# EAGLE design KGGR_MV_su (EAGLE 9.4.2)
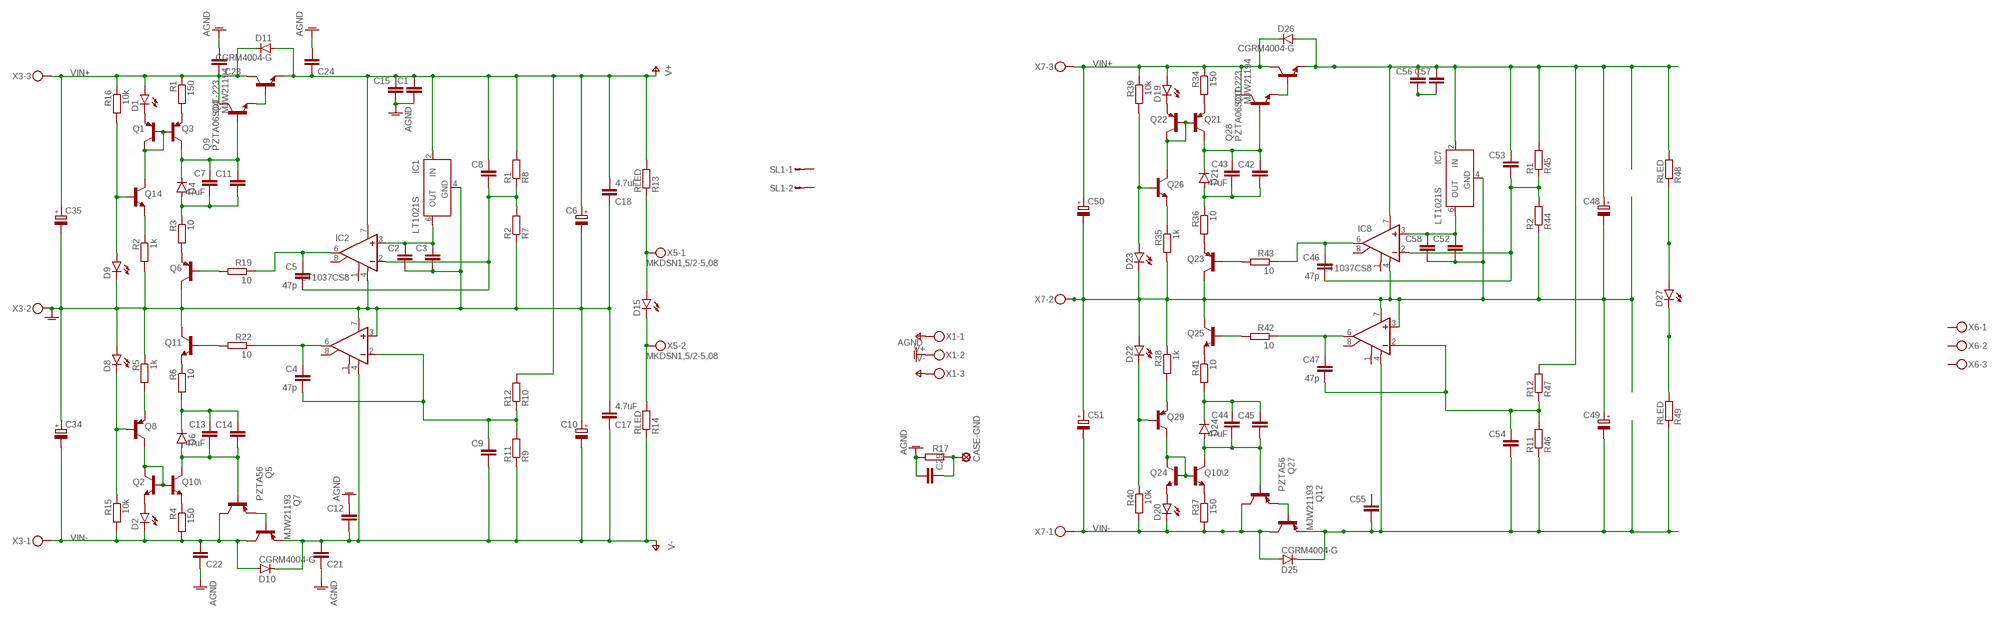
[diagram p0: schematic, sheet 1]

## Parts
C1  C-EUC0805  [C0805]
C2  C-EUC0805  [C0805]
C3  C-EUC0805  [C0805]
C4  47p  C-EUC0805  [C0805]
C5  47p  C-EUC0805  [C0805]
C6  CPOL-EUE5-13  [E5-13]
C7  47uF  C-EUC1206  [C1206]
C8  C-EUC0805  [C0805]
C9  C-EUC0805  [C0805]
C10  CPOL-EUE5-13  [E5-13]
C11  C-EUC0805  [C0805]
C12  C-EUC0805  [C0805]
C13  47uF  C-EUC1206  [C1206]
C14  C-EUC0805  [C0805]
C15  C-EUC0805  [C0805]
C17  4.7uF  C-EU050-075X075  [C050-075X075]
C18  4.7uF  C-EU050-075X075  [C050-075X075]
C21  C-EU050-035X075  [C050-035X075]
C22  C-EU050-075X075  [C050-075X075]
C23  C-EU050-075X075  [C050-075X075]
C24  C-EU050-035X075  [C050-035X075]
C29  C-EU102_152-062X184  [C102_152-062X184]
C34  CPOL-EUE7.5-18  [E7,5-18]
C35  CPOL-EUE7.5-18  [E7,5-18]
C42  C-EUC0805  [C0805]
C43  47uF  C-EUC1206  [C1206]
C44  47uF  C-EUC1206  [C1206]
C45  C-EUC0805  [C0805]
C46  47p  C-EUC0805  [C0805]
C47  47p  C-EUC0805  [C0805]
C48  CPOL-EUE5-13  [E5-13]
C49  CPOL-EUE5-13  [E5-13]
C50  CPOL-EUE7.5-18  [E7,5-18]
C51  CPOL-EUE7.5-18  [E7,5-18]
C52  C-EUC0805  [C0805]
C53  C-EUC0805  [C0805]
C54  C-EUC0805  [C0805]
C55  C-EUC0805  [C0805]
C56  C-EUC0805  [C0805]
C57  C-EUC0805  [C0805]
C58  C-EUC0805  [C0805]
CASE-GND  SE14  [SE14]
D1  LEDSML0805  [SML0805]
D2  LEDSML0805  [SML0805]
D4  TZMC10  DIODE-SOD80C  [SOD80C]
D6  TZAMC10  DIODE-SOD80C  [SOD80C]
D8  LEDSML0805  [SML0805]
D9  LEDSML0805  [SML0805]
D10  CGRM4004-G  [SOD-123_MINI-SMA]
D11  CGRM4004-G  [SOD-123_MINI-SMA]
D15  LEDSML0805  [SML0805]
D19  LEDSML0805  [SML0805]
D20  LEDSML0805  [SML0805]
D21  TZMC10  DIODE-SOD80C  [SOD80C]
D22  LEDSML0805  [SML0805]
D23  LEDSML0805  [SML0805]
D24  TZAMC10  DIODE-SOD80C  [SOD80C]
D25  CGRM4004-G  [SOD-123_MINI-SMA]
D26  CGRM4004-G  [SOD-123_MINI-SMA]
D27  LEDSML0805  [SML0805]
IC1  LT1021S  [SOIC8]
IC2  LT1037CS8  [SOIC8]
IC3  LT1037CS8  [SOIC8]
IC7  LT1021S  [SOIC8]
IC8  LT1037CS8  [SO08]
IC9  LT1037CS8  [SO08]
Q1  TRANSISTOR_BC857C-PNP-SOT23-BEC  [TRANSISTOR_SOT23-BEC]
Q2  TRANSISTOR_BC847CLT1-NPN-SOT23-BEC  [TRANSISTOR_SOT23-BEC]
Q3  TRANSISTOR_BC857C-PNP-SOT23-BEC  [TRANSISTOR_SOT23-BEC]
Q4  MJW21194  MJL4281  [TO-264]
Q5  PZTA56  [SOT223]
Q6  TRANSISTOR_BC857C-PNP-SOT23-BEC  [TRANSISTOR_SOT23-BEC]
Q7  MJW21193  MJL4302  [TO-264]
Q8  TRANSISTOR_BC857C-PNP-SOT23-BEC  [TRANSISTOR_SOT23-BEC]
Q9  PZTA06SOT-223  [SOT223]
Q10  MJW21194  MJL4281  [TO-264]
Q10\  TRANSISTOR_BC847CLT1-NPN-SOT23-BEC  [TRANSISTOR_SOT23-BEC]
Q10\2  TRANSISTOR_BC847CLT1-NPN-SOT23-BEC  [TRANSISTOR_SOT23-BEC]
Q11  TRANSISTOR_BC847CLT1-NPN-SOT23-BEC  [TRANSISTOR_SOT23-BEC]
Q12  MJW21193  MJL4302  [TO-264]
Q14  TRANSISTOR_BC847CLT1-NPN-SOT23-BEC  [TRANSISTOR_SOT23-BEC]
Q21  TRANSISTOR_BC857C-PNP-SOT23-BEC  [TRANSISTOR_SOT23-BEC]
Q22  TRANSISTOR_BC857C-PNP-SOT23-BEC  [TRANSISTOR_SOT23-BEC]
Q23  TRANSISTOR_BC857C-PNP-SOT23-BEC  [TRANSISTOR_SOT23-BEC]
Q24  TRANSISTOR_BC847CLT1-NPN-SOT23-BEC  [TRANSISTOR_SOT23-BEC]
Q25  TRANSISTOR_BC847CLT1-NPN-SOT23-BEC  [TRANSISTOR_SOT23-BEC]
Q26  TRANSISTOR_BC847CLT1-NPN-SOT23-BEC  [TRANSISTOR_SOT23-BEC]
Q27  PZTA56  [SOT223]
Q28  PZTA06SOT-223  [SOT223]
Q29  TRANSISTOR_BC857C-PNP-SOT23-BEC  [TRANSISTOR_SOT23-BEC]
R1  150  R-EU_MELF0204W  [MINI_MELF-0204W]
R2  1k  R-EU_MELF0204W  [MINI_MELF-0204W]
R3  10  R-EU_MELF0204W  [MINI_MELF-0204W]
R4  150  R-EU_MELF0204W  [MINI_MELF-0204W]
R5  1k  R-EU_MELF0204W  [MINI_MELF-0204W]
R6  10  R-EU_MELF0204W  [MINI_MELF-0204W]
R7  R2  R-EU_MELF0204W  [MINI_MELF-0204W]
R8  R1  R-EU_MELF0204W  [MINI_MELF-0204W]
R9  R11  R-EU_MELF0204W  [MINI_MELF-0204W]
R10  R12  R-EU_MELF0204W  [MINI_MELF-0204W]
R13  RLED  R-EU_MELF0204W  [MINI_MELF-0204W]
R14  RLED  R-EU_MELF0204W  [MINI_MELF-0204W]
R15  10k  R-EU_MELF0204W  [MINI_MELF-0204W]
R16  10k  R-EU_MELF0204W  [MINI_MELF-0204W]
R17  R-EU_0617/22  [0617/22]
R19  10  R-EU_MELF0204W  [MINI_MELF-0204W]
R22  10  R-EU_MELF0204W  [MINI_MELF-0204W]
R34  150  R-EU_MELF0204W  [MINI_MELF-0204W]
R35  1k  R-EU_MELF0204W  [MINI_MELF-0204W]
R36  10  R-EU_MELF0204W  [MINI_MELF-0204W]
R37  150  R-EU_MELF0204W  [MINI_MELF-0204W]
R38  1k  R-EU_MELF0204W  [MINI_MELF-0204W]
R39  10k  R-EU_MELF0204W  [MINI_MELF-0204W]
R40  10k  R-EU_MELF0204W  [MINI_MELF-0204W]
R41  10  R-EU_MELF0204W  [MINI_MELF-0204W]
R42  10  R-EU_MELF0204W  [MINI_MELF-0204W]
R43  10  R-EU_MELF0204W  [MINI_MELF-0204W]
R44  R2  R-EU_MELF0204W  [MINI_MELF-0204W]
R45  R1  R-EU_MELF0204W  [MINI_MELF-0204W]
R46  R11  R-EU_MELF0204W  [MINI_MELF-0204W]
R47  R12  R-EU_MELF0204W  [MINI_MELF-0204W]
R48  RLED  R-EU_MELF0204W  [MINI_MELF-0204W]
R49  RLED  R-EU_MELF0204W  [MINI_MELF-0204W]
SL1  M02S  [02P]
X1  MKDSN1,5/3-5,08  [MKDSN1,5/3-5,08]
X3  MKDSN1,5/3-5,08  [MKDSN1,5/3-5,08]
X5  MKDSN1,5/2-5,08  [MKDSN1,5/2-5,08]
X6  MKDSN1,5/3-5,08  [MKDSN1,5/3-5,08]
X7  MKDSN1,5/3-5,08  [MKDSN1,5/3-5,08]

## Nets
AGND: C1.2 C2.2 C3.2 C6.- C10.+ C12.1 C15.2 C17.2 C18.1 C21.1 C22.1 C23.2 C24.2 C29.2 C29.3 C34.+ C35.- C48.- C49.+ C50.- C51.+ C52.2 C55.1 C56.2 C57.2 C58.2 D8.A D9.C D22.A D23.C IC1.4(GND) IC2.4(V-) IC3.3(+IN) IC3.7(V+) IC7.4(GND) IC8.4(V-) IC9.3(+IN) IC9.7(V+) Q6.C Q11.C Q23.C Q25.C R2.2 R5.1 R7.1 R17.2 R35.2 R38.1 R44.1 X1.2 X3.2 X6.2 X7.2
N$1: Q1.B Q1.C Q3.B Q14.C
N$2: D1.C Q1.E
N$3: Q3.E R1.2
N$5: C7.1 C11.1 D4.C Q3.C Q9.1(B)
N$6: C7.2 C11.2 D4.A R3.1
N$7: Q6.E R3.2
N$8: Q14.E R2.1
N$9: D9.A Q14.B R16.2
N$10: C4.1 IC3.6(OUT) R22.1
N$11: Q8.E R5.2
N$12: D8.C Q8.B R15.1
N$13: Q11.E R6.1
N$14: C13.1 C14.1 D6.C R6.2
N$15: C13.2 C14.2 D6.A Q5.1(B) Q10\.C
N$16: Q2.B Q2.C Q8.C Q10\.B
N$17: Q5.3(E) Q7.B
N$18: Q10\.E R4.1
N$19: D2.A Q2.E
N$21: Q4.B Q9.3(E)
N$24: C4.2 C9.1 IC3.2(-IN) R9.2 R10.1
N$25: C5.1 IC2.6(OUT) R19.1
N$26: Q11.B R22.2
N$27: Q6.B R19.2
N$28: C5.2 C8.2 IC2.2(-IN) R7.2 R8.1
N$29: C2.1 C3.1 IC1.6(OUT) IC2.3(+IN)
N$32: D15.C R14.2 X5.2
N$36: D15.A R13.1 X5.1
N$41: C29.1 CASE-GND.MP R17.1
N$56: Q21.B Q22.B Q22.C Q26.C
N$57: D19.C Q22.E
N$58: Q21.E R34.2
N$59: C42.1 C43.1 D21.C Q21.C Q28.1(B)
N$60: C42.2 C43.2 D21.A R36.1
N$61: Q23.E R36.2
N$62: Q26.E R35.1
N$63: D23.A Q26.B R39.2
N$64: Q29.E R38.2
N$65: D22.C Q29.B R40.1
N$66: Q25.E R41.1
N$67: C44.1 C45.1 D24.C R41.2
N$68: C44.2 C45.2 D24.A Q10\2.C Q27.1(B)
N$69: Q10\2.B Q24.B Q24.C Q29.C
N$70: Q10\2.E R37.1
N$71: D20.A Q24.E
N$72: Q12.B Q27.3(E)
N$73: Q10.B Q28.3(E)
N$74: Q25.B R42.2
N$75: Q23.B R43.2
N$76: C46.2 C53.2 IC8.2(-IN) R44.2 R45.1
N$77: D27.C R49.2
N$78: D27.A R48.1
N$79: C47.1 IC9.6(OUT) R42.1
N$80: C47.2 C54.1 IC9.2(-IN) R46.2 R47.1
N$81: C52.1 C58.1 IC7.6(OUT) IC8.3(+IN)
N$82: C46.1 IC8.6(OUT) R43.1
V+: C1.1 C6.+ C8.1 C15.1 C18.2 C24.1 D11.A IC1.2(IN) IC2.7(V+) Q4.E R8.2 R10.2 R13.2 X1.1
V+2: C48.+ C53.1 C56.1 C57.1 D26.A IC7.2(IN) IC8.7(V+) Q10.E R45.2 R47.2 R48.2 X6.1
V-: C9.2 C10.- C12.2 C17.1 C21.2 D10.C IC3.4(V-) Q7.E R9.1 R14.1 X1.3
V-2: C49.- C54.2 C55.2 D25.C IC9.4(V-) Q12.E R46.1 R49.1 X6.3
VIN+: C23.1 C35.+ C50.+ D1.A D11.C D19.A D26.C Q4.C Q9.2(C) Q9.4(C) Q10.C Q28.2(C) Q28.4(C) R1.1 R16.1 R34.1 R39.1 X3.3 X7.3
VIN-: C22.2 C34.- C51.- D2.C D10.A D20.C D25.A Q5.2(C) Q5.4(C) Q7.C Q12.C Q27.2(C) Q27.4(C) R4.2 R15.2 R37.2 R40.2 X3.1 X7.1
Unconnected: IC2.1(CMP1) IC2.8(CMP2) IC3.1(CMP1) IC3.8(CMP2) IC8.1(CMP1) IC8.8(CMP2) IC9.1(CMP1) IC9.8(CMP2) SL1.1 SL1.2

## Library data of the parts
C1-C5 C7-C9 C11-C15 C17 C18 C21-C24 C29 C42-C47 C52-C58 = Vwvwbg:C-EU: CAPACITOR, European symbol
C6 C10 C34 C35 C48-C51 = Vwvwbg:CPOL-EU: POLARIZED CAPACITOR, European symbol
CASE-GND = solpad:SE14: SOLDER PAD E1553, drill 1,4mm, distributor Buerklin, 07F820
D1 D2 D8 D9 D15 D19 D20 D22 D23 D27 = led:LED: LED OSRAM: - CHIPLED LG R971, LG N971, LY N971, LG Q971, LY Q971, LO R971, LY R971 LH N974, LH R974 LS Q976, LO Q976, LY Q976 LO Q996 - Hyper CHIPLED LW Q18S LB Q993, LB Q99A, LB R99A - SideLED LS A670, LO A670, LY A670, LG A670, LP A670 LB A673, LV A673, LT A673, LW A673 LH A674 LY A675 LS A676, LA A676, LO A676, LY A676, LW A676 LS A679, LY A679, LG A679 - Hyper Micro SIDELED® LS Y876, LA Y876, LO Y876, LY Y876 LT Y87S - SmartLED LW L88C, LW L88S LB L89C, LB L89S, LG L890 LS L89K, LO L89K, LY L89K LS L896, LA L896, LO L896, LY L896 - TOPLED LS T670, LO T670, LY T670, LG T670, LP T670 LSG T670, LSP T670, LSY T670, LOP T670, LYG T670 LG T671, LOG T671, LSG T671 LB T673, LV T673, LT T673, LW T673 LH T674 LS T676, LA T676, LO T676, LY T676, LB T676, LH T676, LSB T676, LW T676 LB T67C, LV T67C, LT T67C, LS T67K, LO T67K, LY T67K, LW E67C LS E67B, LA E67B, LO E67B, LY E67B, LB E67C, LV E67C, LT E67C LW T67C LS T679, LY T679, LG T679 LS T770, LO T770, LY T770, LG T770, LP T770 LB T773, LV T773, LT T773, LW T773 LH T774 LS E675, LA E675, LY E675, LS T675 LS T776, LA T776, LO T776, LY T776, LB T776 LHGB T686 LT T68C, LB T68C - Hyper Mini TOPLED® LB M676 - Mini TOPLED Santana® LG M470 LS M47K, LO M47K, LY M47K Source: http://www.osram.convergy.de LUXEON: - LUMILED® LXK2-PW12-R00, LXK2-PW12-S00, LXK2-PW14-U00, LXK2-PW14-V00 LXK2-PM12-R00, LXK2-PM12-S00, LXK2-PM14-U00 LXK2-PE12-Q00, LXK2-PE12-R00, LXK2-PE12-S00, LXK2-PE14-T00, LXK2-PE14-U00 LXK2-PB12-K00, LXK2-PB12-L00, LXK2-PB12-M00, LXK2-PB14-N00, LXK2-PB14-P00, LXK2-PB14-Q00 LXK2-PR12-L00, LXK2-PR12-M00, LXK2-PR14-Q00, LXK2-PR14-R00 LXK2-PD12-Q00, LXK2-PD12-R00, LXK2-PD12-S00 LXK2-PH12-R00, LXK2-PH12-S00 LXK2-PL12-P00, LXK2-PL12-Q00, LXK2-PL12-R00 Source: www.luxeon.com KINGBRIGHT: KA-3528ASYC Source: www.kingbright.com
D4 D6 D21 D24 = diode:DIODE-: DIODE
D10 D11 D25 D26 = diode:CGRM400*-G: Molded plasitc,JEDEC SOD-123/Mini SMA Source: Comchip CGRM4001-G.pdf
IC1 = Vwvwbg:LT1021: Precision Reference Source: http://www.linear.com/pc/downloadDocument.do?navId=H0,C1,C1010,C1603,P1229,D2805; MPN: LT1021DCS8-10#PBF; OC_FARNELL: 1273428; OC_NEWARK: 57M0993
IC2 IC3 = Vwvwbg:LT10*: Low Noise, High Speed, Precision Operational Amplifiers Source: http://www.linear.com/pc/downloadDocument.do?navId=H0,C1,C1154,C1009,C1026,P1212,D2204
IC7 = linear-technology:LT1021: Precision Reference Source: http://www.linear.com/pc/downloadDocument.do?navId=H0,C1,C1010,C1603,P1229,D2805; MPN: LT1021DCS8-10#PBF; OC_FARNELL: 1273428; OC_NEWARK: 57M0993
IC8 IC9 = linear:LT10*: Low Noise, High Speed, Precision Operational Amplifiers Source: http://www.linear.com/pc/downloadDocument.do?navId=H0,C1,C1154,C1009,C1026,P1212,D2204
Q1 Q3 Q6 Q8 Q21-Q23 Q29 = Vwvwbg:TRANSISTOR_*-PNP-: PNP Transistror
Q2 Q10\ Q10\2 Q11 Q14 Q24-Q26 = Vwvwbg:TRANSISTOR_*-NPN-: NPN Transistror BF959 corrected 2008.03.06
Q4 Q10 = TO264:MJL4281: MJL4281 NPN BCE TO-264
Q5 Q27 = Vwvwbg:PZTA56
Q7 Q12 = TO264:MJL4302: MJL4302 PNP BCE TO-264
Q9 Q28 = Vwvwbg:PZTA06
R1-R10 R13-R17 R19 R22 R34-R49 = Vwvwbg:R-EU_: RESISTOR, European symbol
SL1 = con-amp-quick:M02S: AMP QUICK CONNECTOR; OC_FARNELL: unknown; OC_NEWARK: unknown
X1 X3 X6 X7 = con-phoenix-508:MKDSN1,5/3-5,08: MKDSN 1,5/ 3-5,08 Printklemme Nennstrom: 13,5 A Nennspannung: 250 V Rastermaß: 5,08 mm Polzahl: 3 Anschlussart: Schraubanschluss Montage: Löten Anschlussrichtung Leiter/Platine: 0 ° Artikelnummer: 1729131 Source: http://eshop.phoenixcontact.com .. 1729131.pdf
X5 = con-phoenix-508:MKDSN1,5/2-5,08: MKDSN 1,5/ 2-5,08 Printklemme Nennstrom: 13,5 A Nennspannung: 250 V Rastermaß: 5,08 mm Polzahl: 2 Anschlussart: Schraubanschluss Montage: Löten Anschlussrichtung Leiter/Platine: 0 ° Artikelnummer: 1729128 Source: http://eshop.phoenixcontact.com .. 1729128.pdf

## Board
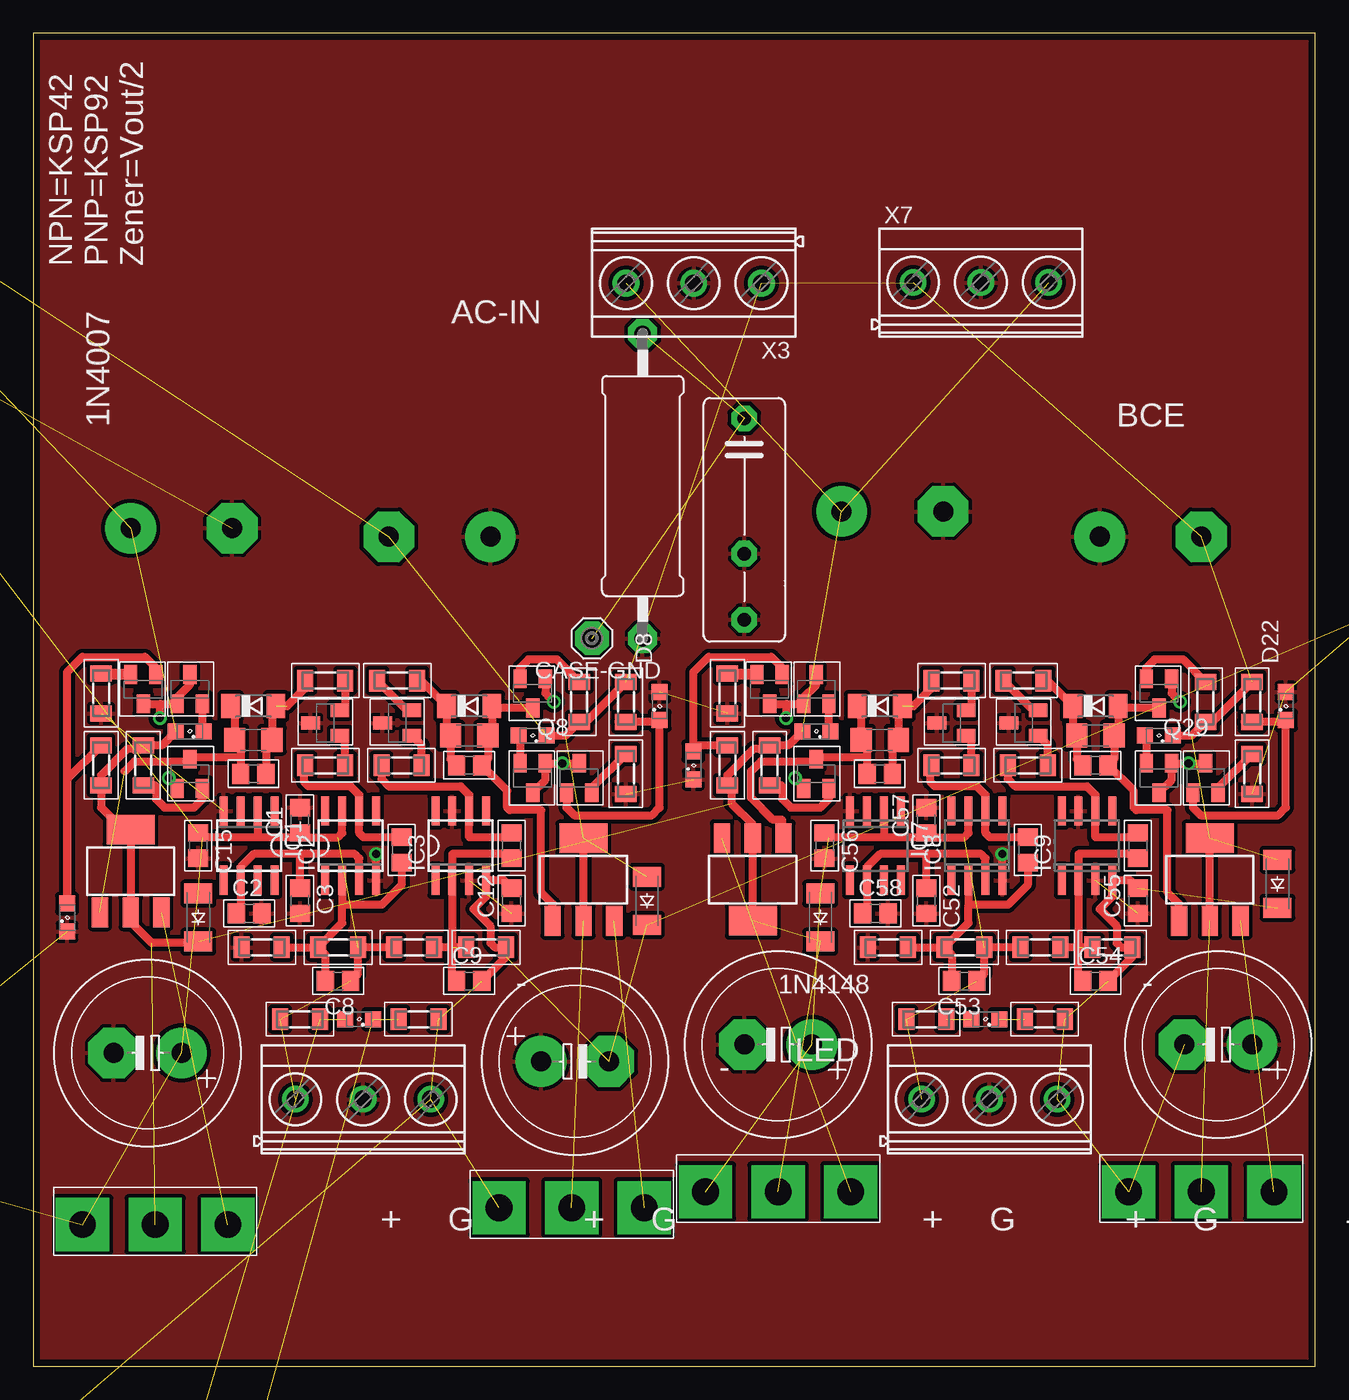
[diagram p1: board, top side]
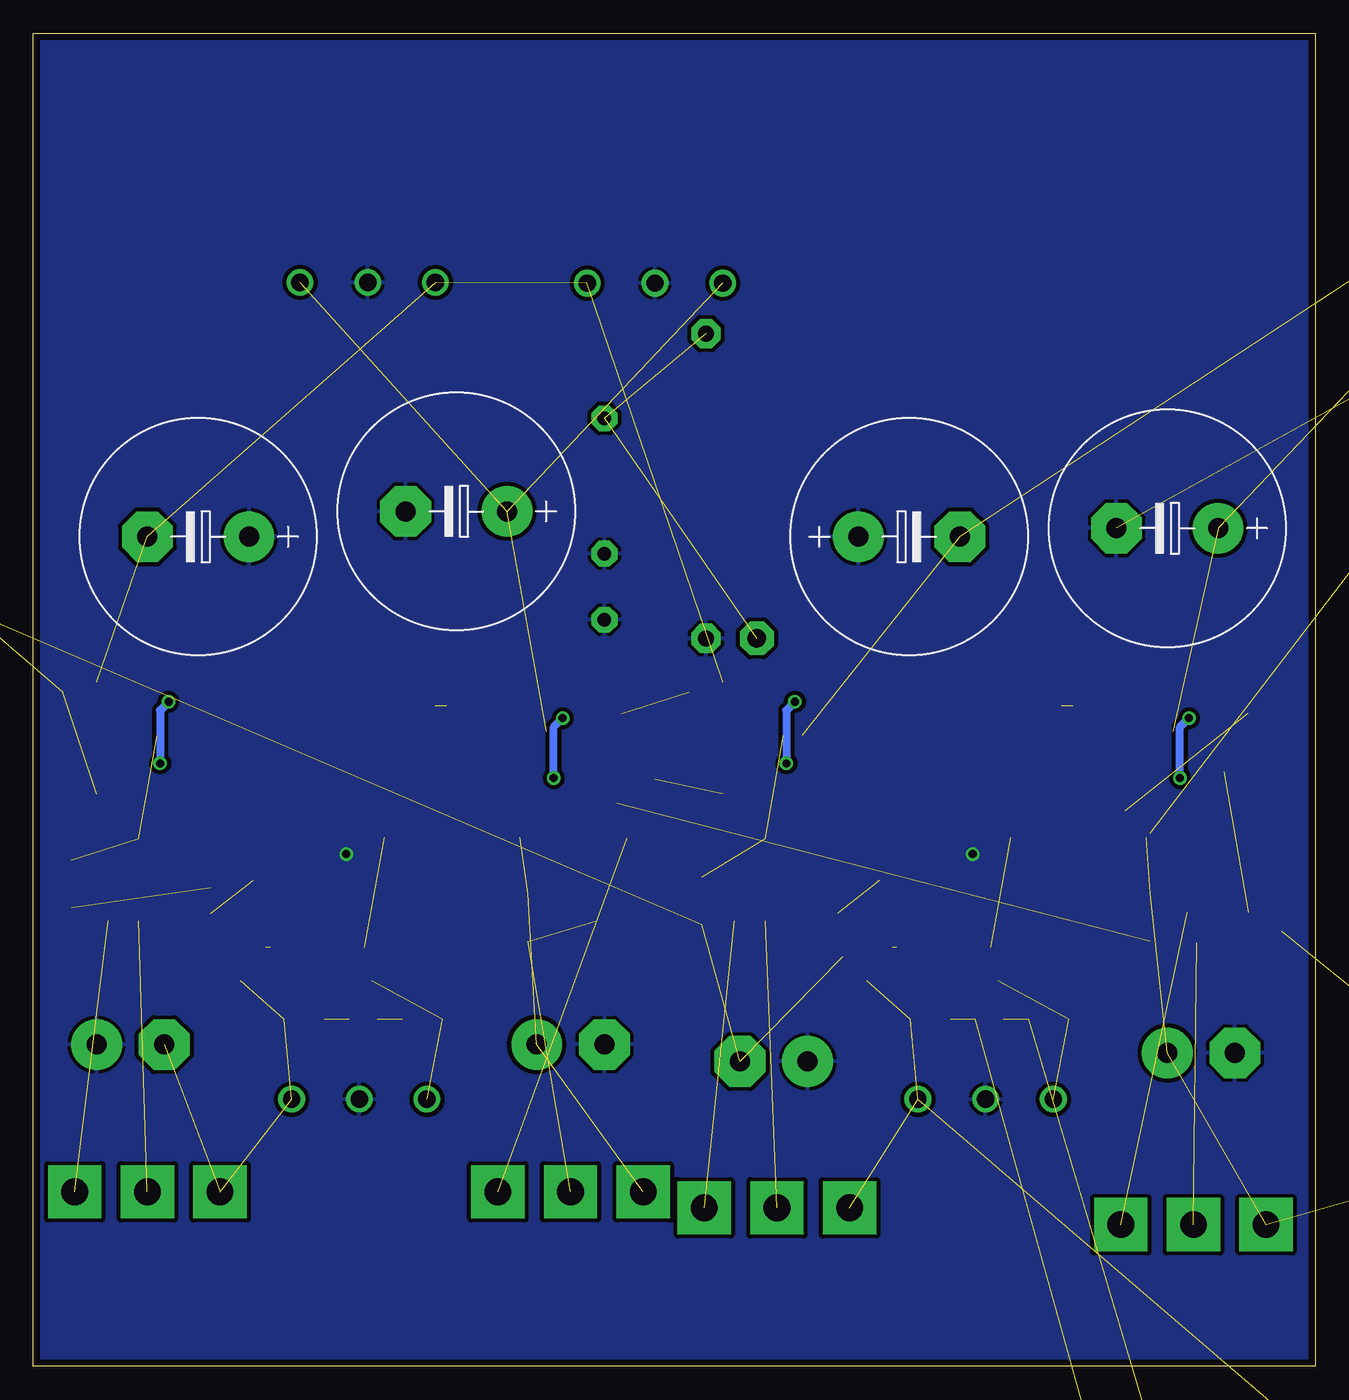
[diagram p2: board, bottom side, seen from below]

Size 96.19 x 100 mm. Coordinates in mm from the lower left corner, seen from the top.
Outline: 0,0 96.19,0 96.19,100 0,100 0,0
Copper layers (1*16): Top 0.035mm / dielectric 1.5mm / Bottom 0.035mm
Design rules "default *": minimum track width 10mil, minimum drill 24mil, track to track 12mil, track to pad 12mil, pad to pad 8mil, via to via 8mil, smd to smd 8mil, copper to edge 20mil, drill to drill 8mil, minimum pad ring 10mil, minimum via ring 8mil, stop-mask expansion 4mil, vias tented up to drill 0mil, thermal gap 10mil

### Footprints (pad centres in the part's own frame; a part is rotated, then mirrored left to right if it is on the bottom)
C0805 = smd 1.3 x 1.5: 1 -0.95,0; 2 0.95,0
E5-13 = drill 1.5 pad 3.81: + -2.54,0 | drill 1.5 pad 3.81 octagon: - 2.54,0
C1206 = smd 1.6 x 1.8: 1 -1.4,0; 2 1.4,0
C050-075X075 = drill 0.813 pad 1.778: 1 -2.54,0; 2 2.54,0
C050-035X075 = drill 0.813 pad 1.778: 1 -2.54,0; 2 2.54,0
C102_152-062X184 = drill 1.016 pad 1.93 octagon: 1 -5.08,0; 2 5.08,0; 3 10.033,0
E7,5-18 = drill 1.5 pad 3.81: + -3.81,0 | drill 1.5 pad 3.81 octagon: - 3.81,0
SE14 = drill 1.397 pad 2.54 octagon: MP 0,0
SML0805 = smd 1.2 x 1.2: A 1.05,0; C -1.05,0
SOD80C = smd 1.4 x 1.8: A 1.7,0; C -1.7,0
SOD-123_MINI-SMA = smd 1.5 x 2.1: A 1.8,0; C -1.8,0
SOIC8 = smd 0.6 x 2.2: 1 -1.905,-2.6; 2 -0.635,-2.6; 3 0.635,-2.6; 4 1.905,-2.6; 5 1.905,2.6; 6 0.635,2.6; 7 -0.635,2.6; 8 -1.905,2.6
SO08 = smd 0.6 x 2.2: 1 -1.905,-2.6; 2 -0.635,-2.6; 3 0.635,-2.6; 4 1.905,-2.6; 5 1.905,2.6; 6 0.635,2.6; 7 -0.635,2.6; 8 -1.905,2.6
TRANSISTOR_SOT23-BEC = smd 1 x 1.4: B -0.95,-1.1; C 0,1.1; E 0.95,-1.1
TO-264 = drill 2 pad 4 square: B -5.45,-6.096; C 0,-6.096; E 5.45,-6.096
SOT223 = smd 1.219 x 2.235: 1 -2.311,-3.099; 2 0,-3.099; 3 2.311,-3.099 | smd 3.6 x 2.2: 4 0,3.099
MINI_MELF-0204W = smd 1.2 x 1.6: 1 -1.5,0; 2 1.5,0
0617/22 = drill 1.2 pad 2.184 octagon: 1 -11.43,0; 2 11.43,0
02P = drill 0.914 long: 1 -1.27,0; 2 1.27,0
MKDSN1,5/3-5,08 = drill 1.3 pad 2: 1 -7.641,0.025; 2 -2.561,0.025; 3 2.519,0.025
MKDSN1,5/2-5,08 = drill 1.3 pad 2: 1 -2.561,0.025; 2 2.519,0.025

### Placement (x,y rotation side)
C1  20,40.96 90 top
C2  16.19,33.97 0 top
C3  20,34.92 270 top
C4  35.88,39.05 270 top
C5  27.62,38.73 270 top
C6  8.57,23.5 180 top
C7  16.51,46.99 0 top
C8  22.86,28.89 180 top
C9  32.7,28.89 0 top
C10  40.64,22.86 0 top
C11  16.51,44.45 0 top
C12  35.88,34.92 90 top
C13  32.7,47.31 0 top
C14  32.7,45.09 0 top
C15  12.38,39.05 270 top
C17  -3.49,-11.11 270 top  (outside the outline)
C18  -12.7,17.78 270 top  (outside the outline)
C21  108.58,60.96 0 top  (outside the outline)
C22  -13.97,91.44 270 bottom  (outside the outline)
C23  -11.43,80.01 270 bottom  (outside the outline)
C24  -13.97,71.12 180 top  (outside the outline)
C29  53.34,66.04 270 top
C34  30.48,62.23 0 bottom
C35  11.11,62.87 180 bottom
C42  63.5,44.45 0 top
C43  63.5,46.99 0 top
C44  79.69,47.31 0 top
C45  79.69,45.09 0 top
C46  74.61,38.73 270 top
C47  82.87,39.05 270 top
C48  55.88,24.13 180 top
C49  88.9,24.13 180 top
C50  64.45,64.14 180 bottom
C51  83.82,62.23 180 bottom
C52  66.99,34.92 270 top
C53  69.85,28.89 180 top
C54  79.69,28.89 0 top
C55  82.87,34.92 90 top
C56  59.37,39.05 270 top
C57  66.99,40.96 90 top
C58  63.18,33.97 0 top
CASE-GND  41.91,54.61 0 top
D1  11.75,47.62 180 top
D2  37.47,47.31 180 top
D4  16.51,49.53 0 top
D6  32.7,49.53 0 top
D8  46.99,49.53 90 top
D9  2.54,33.66 90 top
D10  46.04,34.92 90 top
D11  12.38,33.66 90 top
D15  24.45,26.04 180 top
D19  58.74,47.62 180 top
D20  84.45,47.31 180 top
D21  63.5,49.53 0 top
D22  93.98,49.53 90 top
D23  49.53,45.09 90 top
D24  79.69,49.53 0 top
D25  93.34,36.2 90 top
D26  59.05,33.66 90 top
D27  71.44,26.04 180 top
IC1  16.19,39.05 180 top
IC2  23.81,39.05 0 top
IC3  32.07,39.05 0 top
IC7  63.18,39.05 180 top
IC8  70.8,39.05 0 top
IC9  79.06,39.05 0 top
Q1  11.75,50.8 0 top
Q2  37.47,44.13 180 top
Q3  11.75,44.45 0 top
Q4  9.15,4.52 180 top
Q5  41.27,36.51 0 top
Q6  21.91,48.26 90 top
Q7  40.4,5.79 180 top
Q8  40.96,44.13 0 top
Q9  7.3,37.15 0 top
Q10  55.88,6.99 180 top
Q10\  37.47,50.48 180 top
Q10\2  84.45,50.48 180 top
Q11  27.3,48.26 90 top
Q12  87.63,6.99 180 top
Q14  8.26,50.8 180 top
Q21  58.74,44.45 0 top
Q22  58.74,50.8 0 top
Q23  68.9,48.26 90 top
Q24  84.45,44.13 180 top
Q25  74.3,48.26 90 top
Q26  55.24,50.8 180 top
Q27  88.27,36.51 0 top
Q28  53.98,36.51 180 top
Q29  87.95,44.13 0 top
R1  8.26,45.09 270 top
R2  5.08,50.48 270 top
R3  21.91,51.44 0 top
R4  40.96,49.85 270 top
R5  44.45,44.45 90 top
R6  27.3,51.44 0 top
R7  17.14,31.43 0 top
R8  22.86,31.43 0 top
R9  33.97,31.43 180 top
R10  28.57,31.43 180 top
R13  20,26.04 180 top
R14  28.89,26.04 180 top
R15  44.45,49.85 90 top
R16  5.08,45.09 90 top
R17  45.72,66.04 270 top
R19  21.91,45.09 0 top
R22  27.62,45.09 0 top
R34  55.24,45.09 270 top
R35  52.07,50.48 270 top
R36  68.9,51.44 0 top
R37  87.95,49.85 270 top
R38  91.44,44.45 90 top
R39  52.07,45.09 90 top
R40  91.44,49.85 90 top
R41  74.3,51.44 0 top
R42  74.61,45.09 0 top
R43  68.9,45.09 0 top
R44  64.14,31.43 0 top
R45  69.85,31.43 0 top
R46  80.96,31.43 180 top
R47  75.56,31.43 180 top
R48  66.99,26.04 180 top
R49  75.88,26.04 180 top
SL1  -29.21,-27.94 0 top  (outside the outline)
X1  27.3,20 0 top
X3  46.99,81.28 180 top
X5  7.62,-29.21 0 top  (outside the outline)
X6  74.3,20 0 top
X7  73.66,81.28 0 top

### Tracks (layer width: path | path; a pad name or v marks a point on that pad's centre or on a via)
AGND  (via drill 0.61)  (12 unrouted)
  Top 0.61: IC2.4 v25.72,38.42 | IC8.4 v72.71,38.42
  pour Top: 0,106.68 119.38,106.68 119.38,-1.27 0,-1.27
  pour Bottom: 0,-1.27 0,106.68 119.38,106.68 119.38,-1.27
N$1  (via drill 0.61)
  Top 0.61: Q14.C 9.53,49.7 | 9.53,49.7 Q1.B 10.8,50.17 11.75,51.12 Q1.C | Q3.B 10.8,43.49 v10.16,44.13 | v9.48,48.62 9.53,48.66 9.53,49.7
  Bottom 0.61: v10.16,44.13 10.16,47.94 v9.48,48.62
N$2
  Top 0.61: D1.C 12.7,47.73 Q1.E
N$3
  Top 0.61: Q3.E 12.7,42.54 12.06,41.91 9.84,41.91 9.21,42.55 9.21,43.5 9.12,43.59 R1.2
  Top 0.813: Q3.E
N$5  (1 unrouted)
  Top 0.61: D4.C 15.11,49.23 C7.1 15.56,46.54 15.56,45.72 | 15.56,45.72 C11.1 | 15.56,45.72 11.92,45.72 Q3.C 11.57,45.38 7.59,45.38 6.84,44.63
N$6  (1 unrouted)
  Top 0.61: D4.A 17.91,49.23 C7.2 17.46,46.54 C11.2 | R3.1 20.32,51.35 20.32,50.8 19.05,49.53
N$7
  Top 0.61: R3.2 23.41,49.61 Q6.E
N$8
  Top 0.813: Q14.E 5.16,51.9 R2.1
N$9
  Top 0.61: 5.17,46.67 R16.2 2.54,44.05 D9.A 2.54,52.07 3.68,53.21 8.38,53.21 9.21,52.39 Q14.B
N$10
  Top 0.61: C4.1 35.56,39.69 32.7,39.69 IC3.6 32.7,42.86 32.07,43.5 26.67,43.5 26.12,44.05 R22.1
N$11
  Top 0.61: R5.2 41.91,43.41 Q8.E
N$12
  Top 0.61: 43.9,48.35 R15.1 | R15.1 44.58,48.48 | Q8.B 40.01,41.91 40.59,41.32 46.4,41.32 46.99,41.91 D8.C 46.86,48.35 R15.1
N$13
  Top 0.61: R6.1 28.03,49.21 Q11.E
N$14
  Top 0.61: R6.2 29.1,51.44 D6.C 31,47.61 C13.1 31.3,45.53 C14.1
N$15
  Top 0.61: Q10\.C 34.55,49.38 D6.A 34.4,47.61 C13.2 34.1,45.53 C14.2 35.56,43.18 35.56,41.91 35.75,41.72 38.1,41.72 38.1,35.56 38.96,34.7 Q5.1
N$16  (via drill 0.61)
  Top 0.61: Q2.C 38.41,43.98 Q2.B v39.69,45.23 Q8.C | Q10\.B 38.41,50.49 38.58,50.34 38.58,50.33 v39.05,49.85
  Bottom 0.61: v39.05,49.85 39.69,49.21 v39.69,45.23
N$17  (1 unrouted)
N$18
  Top 0.61: R4.1 39.28,53.02 37.15,53.02 36.51,52.39 Q10\.E
N$19
  Top 0.61: D2.A 36.52,47.21 Q2.E
N$21  (1 unrouted)
N$24  (1 unrouted)
  Top 0.61: C4.2 35.56,38.42 31.43,38.42 IC3.2 31.43,31.43 | 31.75,31.43 | R9.2 31.43,31.43 | 31.43,31.43 R10.1 | C9.1 31.43,29.21 31.43,31.43
N$25
  Top 0.61: C5.1 24.77,39.69 24.45,40.01 IC2.6 24.45,42.86 23.81,43.5 20.64,43.5 20.32,43.81 20.32,45 R19.1
N$26
  Top 0.61: R22.2 29.12,46.59 Q11.B
N$27
  Top 0.61: R19.2 23.41,46.91 Q6.B
N$28
  Top 0.61: C5.2 27.62,36.09 26.14,34.61 23.18,34.61 | IC2.2 23.18,34.61 | R7.2 R8.1 | R8.1 23.18,33.25 23.18,34.61 | R8.1 21.91,30.88 C8.2
N$29
  Top 0.61: C2.1 15.56,34.29 IC1.6 15.56,37.45 16.53,38.42 20,38.42 | IC2.3 24.45,38.1 24.13,38.42 20,38.42 | C3.1 20,38.42
N$32  (2 unrouted)
N$36  (2 unrouted)
N$41  (2 unrouted)
N$56  (via drill 0.61)
  Top 0.61: Q26.C 56.52,49.7 | 56.52,49.7 Q22.B 57.79,50.17 58.74,51.12 Q22.C | Q21.B 57.79,43.49 v57.15,44.13 | v56.48,48.62 56.52,48.66 56.52,49.7
  Bottom 0.61: v57.15,44.13 57.15,47.94 v56.48,48.62
N$57
  Top 0.61: D19.C 59.69,47.73 Q22.E
N$58
  Top 0.61: Q21.E 59.69,42.54 59.05,41.91 56.83,41.91 56.2,42.55 56.2,43.5 56.11,43.59 R34.2
  Top 0.813: Q21.E
N$59
  Top 0.61: D21.C 62.1,49.23 C43.1 62.55,46.54 62.55,45.72 | 62.55,45.72 C42.1 | 62.55,45.72 58.91,45.72 Q21.C 58.56,45.38 54.58,45.38 53.84,44.63 53.84,42.66 55.5,41 56.16,41 56.2,40.96 56.2,39.7 Q28.1
N$60  (1 unrouted)
  Top 0.61: D21.A 64.9,49.23 C43.2 64.45,46.54 C42.2 | R36.1 67.31,51.35 67.31,50.8 66.04,49.53
N$61
  Top 0.61: R36.2 70.4,49.61 Q23.E
N$62
  Top 0.813: Q26.E 52.15,51.9 R35.1
N$63
  Top 0.61: 52.16,46.67 R39.2 49.98,46.59 D23.A 49.53,52.07 50.67,53.21 55.38,53.21 56.2,52.39 Q26.B
N$64
  Top 0.61: R38.2 88.9,43.41 Q29.E
N$65
  Top 0.61: 90.89,48.35 R40.1 | R40.1 91.57,48.48 | Q29.B 87,41.91 87.58,41.32 93.39,41.32 93.98,41.91 D22.C 93.85,48.35 R40.1
N$66
  Top 0.61: R41.1 75.02,49.21 Q25.E
N$67
  Top 0.61: R41.2 76.09,51.44 D24.C 77.99,47.61 C44.1 78.29,45.53 C45.1
N$68
  Top 0.61: Q10\2.C 81.54,49.38 D24.A 81.39,47.61 C44.2 81.09,45.53 C45.2 82.55,43.18 82.55,41.91 82.74,41.72 85.09,41.72 85.09,35.56 85.95,34.7 Q27.1
N$69  (via drill 0.61)
  Top 0.61: Q24.C 85.41,43.98 Q24.B v86.68,45.23 Q29.C | Q10\2.B 85.41,50.49 85.56,50.34 85.56,50.33 v86.04,49.85
  Bottom 0.61: v86.04,49.85 86.68,49.21 v86.68,45.23
N$70
  Top 0.61: R37.1 86.27,53.02 84.14,53.02 83.5,52.39 Q10\2.E
N$71
  Top 0.61: D20.A 83.5,47.21 Q24.E
N$72  (1 unrouted)
N$73  (1 unrouted)
N$74
  Top 0.61: R42.2 76.11,46.59 Q25.B
N$75
  Top 0.61: R43.2 70.4,46.91 Q23.B
N$76
  Top 0.61: C46.2 74.61,36.09 73.12,34.61 70.17,34.61 | IC8.2 70.17,34.61 | R44.2 R45.1 | R45.1 70.17,33.25 70.17,34.61 | R45.1 68.9,30.88 C53.2
N$77  (1 unrouted)
N$78  (1 unrouted)
N$79
  Top 0.61: C47.1 82.55,39.69 79.69,39.69 IC9.6 79.69,42.86 79.06,43.5 73.66,43.5 73.11,44.05 R42.1
N$80  (1 unrouted)
  Top 0.61: C47.2 82.55,38.42 78.42,38.42 IC9.2 78.42,31.43 | 78.74,31.43 | R46.2 78.42,31.43 | 78.42,31.43 R47.1 | C54.1 78.42,29.21 78.42,31.43
N$81
  Top 0.61: C58.1 62.55,34.29 IC7.6 62.55,37.45 63.52,38.42 66.99,38.42 | IC8.3 71.44,38.1 71.12,38.42 66.99,38.42 | C52.1 66.99,38.42
N$82
  Top 0.61: C46.1 71.76,39.69 71.44,40.01 IC8.6 71.44,42.86 70.8,43.5 67.63,43.5 67.31,43.81 67.31,45 R43.1
V+  (8 unrouted)
  Top 0.61: C15.1 12.7,39.69 16.83,39.69 | 16.83,39.69 19.68,39.69 C1.1 20.32,39.69 22.86,39.69 23.18,40.01 IC2.7 | IC1.2 16.83,39.69 | C8.1 24.36,29.44 R8.2 R10.2
V+2  (6 unrouted)
  Top 0.61: C56.1 59.69,39.69 63.82,39.69 | 63.82,39.69 66.67,39.69 C57.1 67.31,39.69 69.85,39.69 70.17,40.01 IC8.7 | IC7.2 63.82,39.69 | C53.1 71.35,29.44 R45.2 R47.2
V-  (7 unrouted)
  Top 0.61: C12.2 35.3,36.45 IC3.4 33.97,35.24 33.02,34.29 34.29,33.02 34.29,31.75 34.61,31.43 R9.1 35.47,30.71 C9.2
V-2  (5 unrouted)
  Top 0.61: C55.2 82.29,36.45 IC9.4 80.96,35.24 80.01,34.29 81.28,33.02 81.28,31.75 81.6,31.43 R46.1 82.46,30.71 C54.2
VIN+  (9 unrouted)
  Top 0.61: D1.A 9.66,46.59 R1.1 7.96,46.29 7.05,46.29 5.08,44.32 5.08,43.76 5.25,43.59 | 5.4,43.27 R16.1 5.08,41.91 6.74,40.25 Q9.4 Q9.2 7.3,33.34 8.89,31.75 12.28,31.75 D11.C | D19.A 56.65,46.59 R34.1 54.95,46.29 54.04,46.29 52.07,44.32 52.07,43.76 52.24,43.59 | Q28.4 Q28.2 53.98,40.64 52.39,42.23 52.39,43.27 R39.1
  Top 0.813: 5.25,43.59 R16.1 | 52.24,43.59 R39.1
VIN-  (12 unrouted)
  Top 0.61: D2.C 39.92,47.31 R4.2 41.45,48.35 R15.2 | Q5.2 Q5.4 | D20.C 86.91,47.31 R37.2 88.44,48.35 R40.2 | Q27.2 Q27.4

### Text on the board
Top: Mod By VwV
tPlace: NPN=KSP42 / PNP=KSP92 / Zener=Vout/2 | AC-IN | 1N4007 | BCE | 1N4007 | Vout=LT1021 * [ 1+ ( R1/R2 ) ] | - | - | LED | - | - | - | -
tNames: 1N4148 | + | G | + | G | + | G | + | G
tStop: Mod By VwV